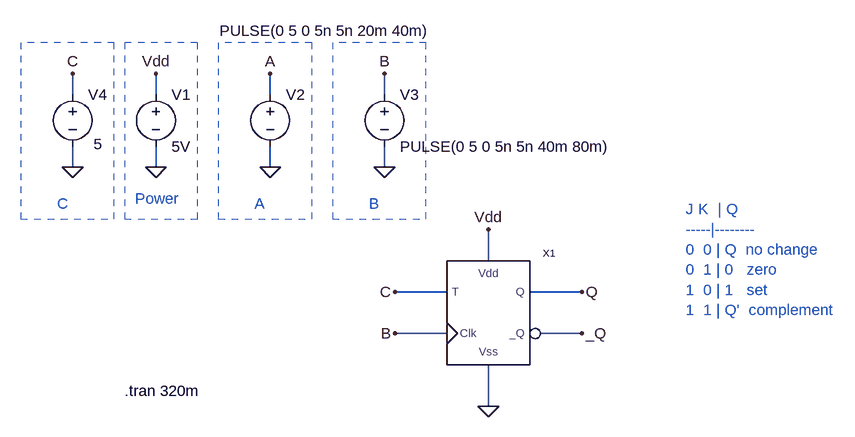
[diagram p0: schematic tff_p_block.asc]
tff_p_block.asc, the LTspice schematic file:
Version 4
SHEET 1 880 680
WIRE -688 -416 -688 -448
WIRE -560 -416 -560 -448
WIRE -384 -416 -384 -448
WIRE -208 -416 -208 -448
WIRE -688 -304 -688 -336
WIRE -560 -304 -560 -336
WIRE -384 -304 -384 -336
WIRE -208 -304 -208 -336
WIRE -48 -160 -48 -208
WIRE -112 -112 -192 -112
WIRE 96 -112 16 -112
WIRE -112 -48 -192 -48
WIRE 96 -48 32 -48
WIRE -48 64 -48 0
FLAG 96 -112 Q
FLAG -192 -112 C
FLAG -48 -208 Vdd
FLAG -48 64 0
FLAG -560 -304 0
FLAG -560 -448 Vdd
FLAG -384 -304 0
FLAG -384 -448 A
FLAG -192 -48 B
FLAG -208 -304 0
FLAG -208 -448 B
FLAG 96 -48 _Q
FLAG -688 -304 0
FLAG -688 -448 C
SYMBOL voltage -560 -432 R0
WINDOW 123 0 0 Left 0
WINDOW 39 0 0 Left 0
SYMATTR InstName V1
SYMATTR Value 5V
SYMBOL voltage -384 -432 R0
WINDOW 123 0 0 Left 0
WINDOW 39 0 0 Left 0
WINDOW 3 -78 -82 Left 2
SYMATTR Value PULSE(0 5 0 5n 5n 20m 40m)
SYMATTR InstName V2
SYMBOL voltage -208 -432 R0
WINDOW 123 0 0 Left 0
WINDOW 39 0 0 Left 0
SYMATTR InstName V3
SYMATTR Value PULSE(0 5 0 5n 5n 40m 80m)
SYMBOL voltage -688 -432 R0
WINDOW 123 0 0 Left 0
WINDOW 39 0 0 Left 0
WINDOW 3 32 92 Left 2
SYMATTR Value 5
SYMATTR InstName V4
SYMBOL tff_p -112 0 R0
SYMATTR InstName X1
TEXT -592 -256 Left 2 ;Power
TEXT -408 -248 Left 2 ;A
TEXT -608 40 Left 2 !.tran 320m
TEXT -232 -248 Left 2 ;B
TEXT 256 -240 Left 2 ;J K  | Q\n-----|--------\n0  0 | Q  no change\n0  1 | 0   zero\n1  0 | 1   set\n1  1 | Q'  complement
TEXT -712 -248 Left 2 ;C
RECTANGLE Normal -496 -496 -608 -224 2
RECTANGLE Normal -320 -496 -464 -224 2
RECTANGLE Normal -144 -496 -288 -224 2
RECTANGLE Normal -624 -496 -768 -224 2

The netlist it stands for:
* tff_p_block.asc
V1 Vdd 0 5V
V2 A 0 PULSE(0 5 0 5n 5n 20m 40m)
V3 B 0 PULSE(0 5 0 5n 5n 40m 80m)
V4 C 0 5
XX1 C B Q _Q Vdd 0 tff_p  ; pins T Clk Q _Q Vdd Vss
* Power
* A
.tran 320m
* B
* J K  | Q
* -----|--------
* 0  0 | Q  no change
* 0  1 | 0   zero
* 1  0 | 1   set
* 1  1 | Q'  complement
* C
.backanno
.end